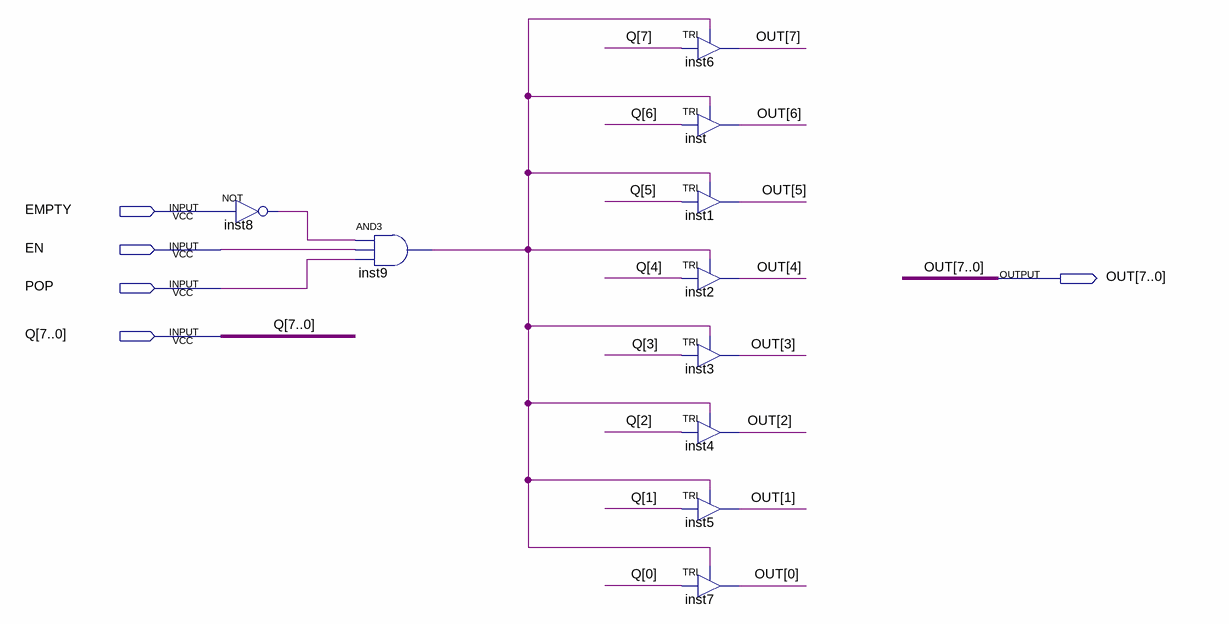
[diagram p0: schematic sheet]
// Quartus schematic TRI_STATE.bdf as structural Verilog: 10 symbols, 5 pins
module TRI_STATE (
  input  EMPTY,
  input  EN,
  input  POP,
  input  [7:0] Q,
  output [7:0] OUT
);

  wire inst8_out, inst9_out;

  not inst8 (inst8_out, EMPTY);
  and inst9 (inst9_out, inst8_out, EN, POP);
  TRI inst6 (.IN(Q[7]), .OE(inst9_out), .OUT(OUT[7]));
  TRI inst (.IN(Q[6]), .OE(inst9_out), .OUT(OUT[6]));
  TRI inst1 (.IN(Q[5]), .OE(inst9_out), .OUT(OUT[5]));
  TRI inst2 (.IN(Q[4]), .OE(inst9_out), .OUT(OUT[4]));
  TRI inst3 (.IN(Q[3]), .OE(inst9_out), .OUT(OUT[3]));
  TRI inst4 (.IN(Q[2]), .OE(inst9_out), .OUT(OUT[2]));
  TRI inst5 (.IN(Q[1]), .OE(inst9_out), .OUT(OUT[1]));
  TRI inst7 (.IN(Q[0]), .OE(inst9_out), .OUT(OUT[0]));
endmodule
